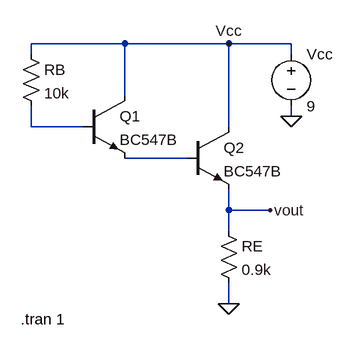
[diagram p0: schematic pol.asc]
pol.asc, the LTspice schematic file:
Version 4
SHEET 1 880 680
WIRE 176 32 32 32
WIRE 336 32 176 32
WIRE 432 32 336 32
WIRE 32 48 32 32
WIRE 432 48 432 32
WIRE 176 112 176 32
WIRE 432 144 432 128
WIRE 32 160 32 128
WIRE 112 160 32 160
WIRE 336 160 336 32
WIRE 272 208 176 208
WIRE 336 288 336 256
WIRE 400 288 336 288
WIRE 336 320 336 288
WIRE 336 432 336 400
FLAG 432 144 0
FLAG 336 432 0
FLAG 400 288 vout
FLAG 336 32 Vcc
SYMBOL npn 112 112 R0
SYMATTR InstName Q1
SYMATTR Value BC547B
SYMBOL npn 272 160 R0
SYMATTR InstName Q2
SYMATTR Value BC547B
SYMBOL res 16 32 R0
SYMATTR InstName RB
SYMATTR Value 10k
SYMBOL voltage 432 32 R0
WINDOW 123 0 0 Left 0
WINDOW 39 0 0 Left 0
SYMATTR InstName Vcc
SYMATTR Value 9
SYMBOL res 320 304 R0
SYMATTR InstName RE
SYMATTR Value 0.9k
TEXT 16 456 Left 2 !.tran 1

The netlist it stands for:
* pol.asc
Q1 Vcc N001 N002 0 BC547B
Q2 Vcc N002 vout 0 BC547B
RB Vcc N001 10k
Vcc Vcc 0 9
RE vout 0 0.9k
.model NPN NPN
.model PNP PNP
.lib standard.bjt
.tran 1
.backanno
.end